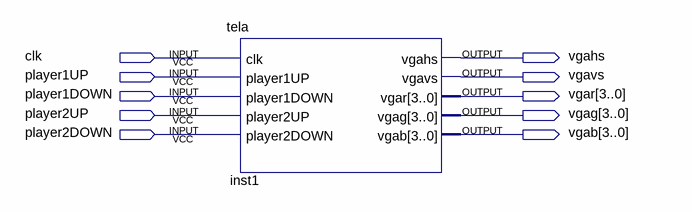
[diagram p0: schematic sheet]
// Quartus schematic grafico.bdf as structural Verilog: 1 symbols, 10 pins
module grafico (
  input  clk,
  input  player1UP,
  input  player1DOWN,
  input  player2UP,
  input  player2DOWN,
  output vgahs,
  output vgavs,
  output [3:0] vgar,
  output [3:0] vgag,
  output [3:0] vgab
);

  tela inst1 (
    .clk(clk), .player1UP(player1UP), .player1DOWN(player1DOWN), .player2UP(player2UP),
    .player2DOWN(player2DOWN), .vgahs(vgahs), .vgavs(vgavs), .vgar(vgar), .vgag(vgag), .vgab(vgab));
endmodule
